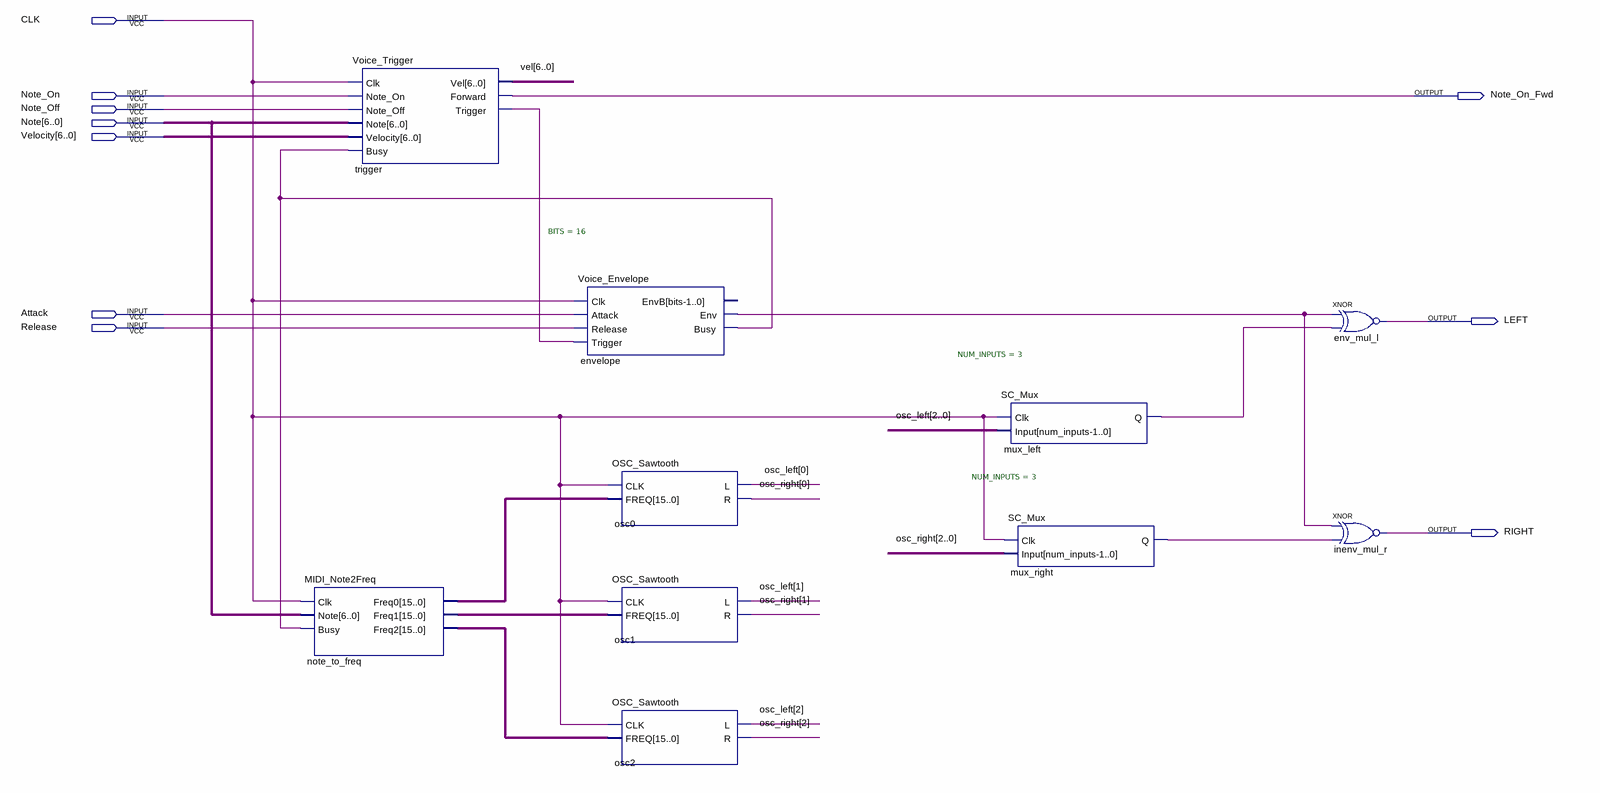
[diagram p0: schematic sheet]
// Quartus schematic Voice.bdf as structural Verilog: 10 symbols, 10 pins
module Voice (
  input  CLK,
  input  Note_On,
  input  Note_Off,
  input  [6:0] Note,
  input  [6:0] Velocity,
  input  Attack,
  input  Release,
  output Note_On_Fwd,
  output LEFT,
  output RIGHT
);

  wire envelope_busy, envelope_env, mux_left_q, mux_right_q, trigger_trigger;
  wire [2:0] osc_left, osc_right;
  wire [6:0] vel;
  wire [15:0] note_to_freq_freq0, note_to_freq_freq1, note_to_freq_freq2;

  MIDI_Note2Freq note_to_freq (
    .Clk(CLK), .Note(Note), .Busy(envelope_busy), .Freq0(note_to_freq_freq0), .Freq1(note_to_freq_freq1),
    .Freq2(note_to_freq_freq2));
  Voice_Trigger trigger (
    .Clk(CLK), .Note_On(Note_On), .Note_Off(Note_Off), .Note(Note), .Velocity(Velocity),
    .Busy(envelope_busy), .Vel(vel), .Forward(Note_On_Fwd), .Trigger(trigger_trigger));
  Voice_Envelope #(.BITS(16)) envelope (
    .Clk(CLK), .Attack(Attack), .Release(Release), .Trigger(trigger_trigger), .Env(envelope_env),
    .Busy(envelope_busy));  // open: EnvB
  OSC_Sawtooth osc0 (.CLK(CLK), .FREQ(note_to_freq_freq0), .L(osc_left[0]), .R(osc_right[0]));
  OSC_Sawtooth osc1 (.CLK(CLK), .FREQ(note_to_freq_freq1), .L(osc_left[1]), .R(osc_right[1]));
  OSC_Sawtooth osc2 (.CLK(CLK), .FREQ(note_to_freq_freq2), .L(osc_left[2]), .R(osc_right[2]));
  SC_Mux #(.NUM_INPUTS(3)) mux_left (.Clk(CLK), .Input(osc_left), .Q(mux_left_q));
  SC_Mux #(.NUM_INPUTS(3)) mux_right (.Clk(CLK), .Input(osc_right), .Q(mux_right_q));
  xnor env_mul_l (LEFT, envelope_env, mux_left_q);
  xnor inenv_mul_r (RIGHT, envelope_env, mux_right_q);
endmodule
